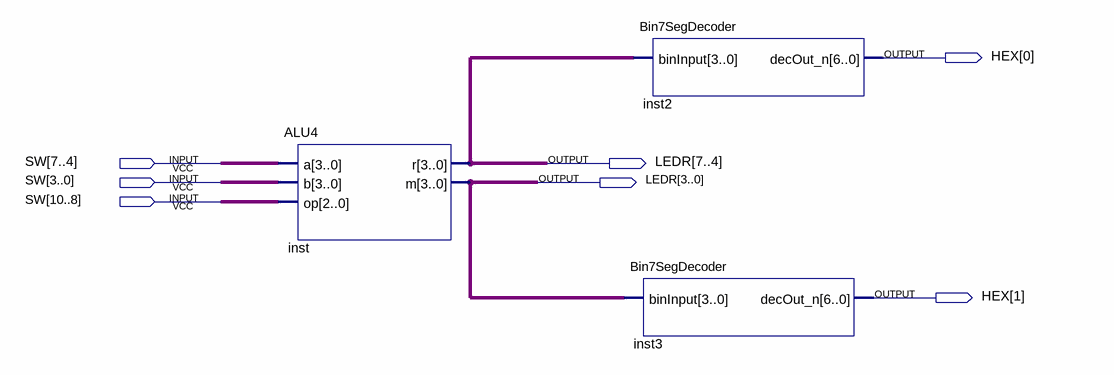
[diagram p0: schematic sheet]
// Quartus schematic ALUDemo.bdf as structural Verilog: 3 symbols, 7 pins
module ALUDemo (
  input  [10:0] SW,
  output [1:0] HEX,
  output [7:0] LEDR
);

  ALU4 inst (.a(SW[7:4]), .b(SW[3:0]), .op(SW[10:8]), .r(LEDR[7:4]), .m(LEDR[3:0]));
  Bin7SegDecoder inst2 (.binInput(LEDR[7:4]), .decOut_n(HEX[0]));
  Bin7SegDecoder inst3 (.binInput(LEDR[3:0]), .decOut_n(HEX[1]));
endmodule
